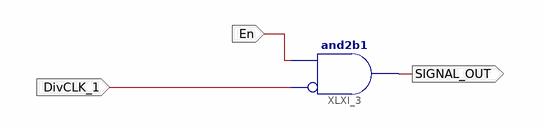
[diagram p0: schematic sheet 1]
// Xilinx ISE schematic SNAGGLE_RX.sch (spartan3e) as structural Verilog: 1 symbols, 3 ports
module SNAGGLE_RX (
  input  En,
  input  DivCLK_1,
  output SIGNAL_OUT
);

  and XLXI_3 (SIGNAL_OUT, ~DivCLK_1, En);  // and2b1
endmodule
